# Altium schematic sheet Relay.SchDoc: RELAY
size 420 x 297 mm; DrawnBy: Hung Vo; SheetNumber: 3; SheetTotal: 4; MasterProject: BTL TKHTN
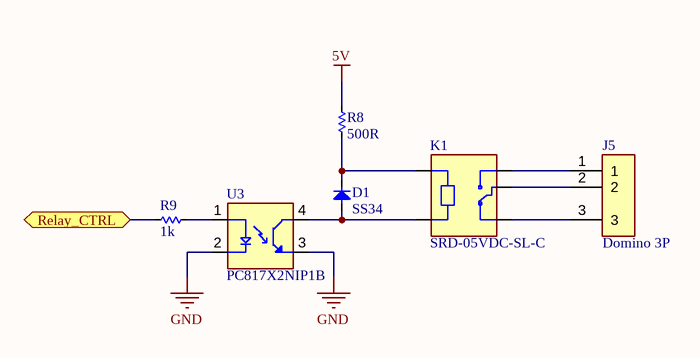
[diagram p0: Relay.SchDoc]

## Parts
D1  SS34  [DO-214AC_SMA]
J5  Domino 3P  [Terminal Domino 3P]
K1  SRD-05VDC-SL-C  [RELAY_SRD-05VDC-SL-C]
R8  500R  [RES_C_1608X60]
R9  1k  [RES_C_1608X60]
U3  PC817X2NIP1B  [SOIC254P960X420-4N]

## Ports
Relay_CTRL (bidir, see MCU[1B])

## Nets
5V: R8.2
GND: U3.2(C) U3.3(ET)
Relay_CTRL: R9.1 ; port Relay_CTRL
NetD1_1: D1.1(K) K1.A1 R8.1
NetD1_2: D1.2(A) K1.A2 U3.4(CT)
NetJ5_1: J5.1 K1.NO
NetJ5_2: J5.2 K1.COM
NetJ5_3: J5.3 K1.NC
NetR9_2: R9.2 U3.1(A)

## Notes on the sheet
- Sub-system:
- Project:
- Design by:
- Sheet title:
- Sheet
- of
- Checked by:
- Approved by:
- Doc No:
- Revision:
- Size:
- Date:
- A3

## Library data of the parts
D1 = Diode SMD: Default Diode; Code - JEDEC: DO-214-AB; Value: 1N5007; Published: 8-Jun-2000; Revision: July-2002: Re-released for DXP Platform.; Publisher: Altium Limited
K1 = SRD-05VDC-SL-C: 5V Trigger Relay Module For Arduino And Raspberry Pi 5V Trigger Relay Module For Arduino And Raspberry Pi; MF: Songle Relay; Check_prices: https://www.snapeda.com/parts/SRD-05VDC-SL-C/Songle+Relay/view-part/?ref=eda; Value: *; Availability: Not in stock; Price: None; Package: NON STANDARD-5 Songle Relay; MP: SRD-05VDC-SL-C; SnapEDA_Link: https://www.snapeda.com/parts/SRD-05VDC-SL-C/Songle+Relay/view-part/?ref=snap
R8 R9 = RES_SMD: RES
U3 = PC817X2NIP1B: Optocoupler DC-IN 1-CH Transistor DC-OUT 4-Pin DIP SMD T/R; MF: Sharp Microelectronics; SnapEDA_Link: https://www.snapeda.com/parts/PC817X2NIP1B/Sharp+Microelectronics/view-part/?ref=snap; Package: SMD-4 Sharp Microelectronics; Value: *; MP: PC817X2NIP1B; Check_prices: https://www.snapeda.com/parts/PC817X2NIP1B/Sharp+Microelectronics/view-part/?ref=eda